# Altium project PCB_Project.PrjPcb
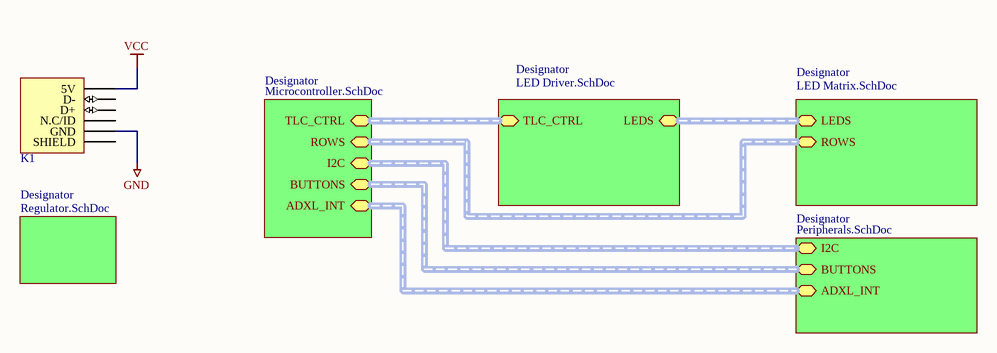
[diagram p0: RGB_Matrix.SchDoc]
6 sheets, 106 parts. Net scope: hierarchical (ports join the sheet entries above them; power ports are global).
Sheets:
  RGB_Matrix.SchDoc
    Designator = LED Matrix.SchDoc
    Designator = LED Driver.SchDoc
    Designator = Microcontroller.SchDoc
    Designator = Regulator.SchDoc
    Designator = Peripherals.SchDoc

## Sheet RGB_Matrix.SchDoc
size A

### Parts
K1  USB_CONNECTOR_5P  [USB_MINI_SMD]  (value not drawn)

### Sub-sheets
Designator = LED Matrix.SchDoc: LEDS (harness LEDS), ROWS (harness ROWS)
Designator = LED Driver.SchDoc: TLC_CTRL (harness TLC_CTRL), LEDS (harness LEDS)
Designator = Microcontroller.SchDoc: TLC_CTRL (harness TLC_CTRL), ROWS (harness ROWS), I2C (harness I2C), ADXL_INT (harness ADXL_INT), BUTTONS (harness BUTTONS)
Designator = Regulator.SchDoc: no entries
Designator = Peripherals.SchDoc: I2C (harness I2C), ADXL_INT (harness ADXL_INT), BUTTONS (harness BUTTONS)

### Nets
GND: K1.5(GND)
VCC: K1.1(5V)

Not connected (* = marked no-connect by the designer): K1 0(SHIELD) 2(D-) 3(D+) 4(N.C/ID)

### Library data of the parts
K1 = 1753: KONTAKT, SMD; id: 1753; rad: 11; rom: OV; lager_type: Fremlager; dybde: 1; hylle: 6; antall: 200; pakke_opprettet_av: 924; navn: USB mini; pris: 8; nokkelord: USB, USB mini, kontakt, SMD; kolonne: 1; pakke_opprettet: 30-Jul-15 6:08:19 PM; symbol_opprettet_av: 924; symbol_opprettet: 30-Jul-15 6:06:06 PM; pakketype: SMD

## Sheet LED Matrix.SchDoc
size A2
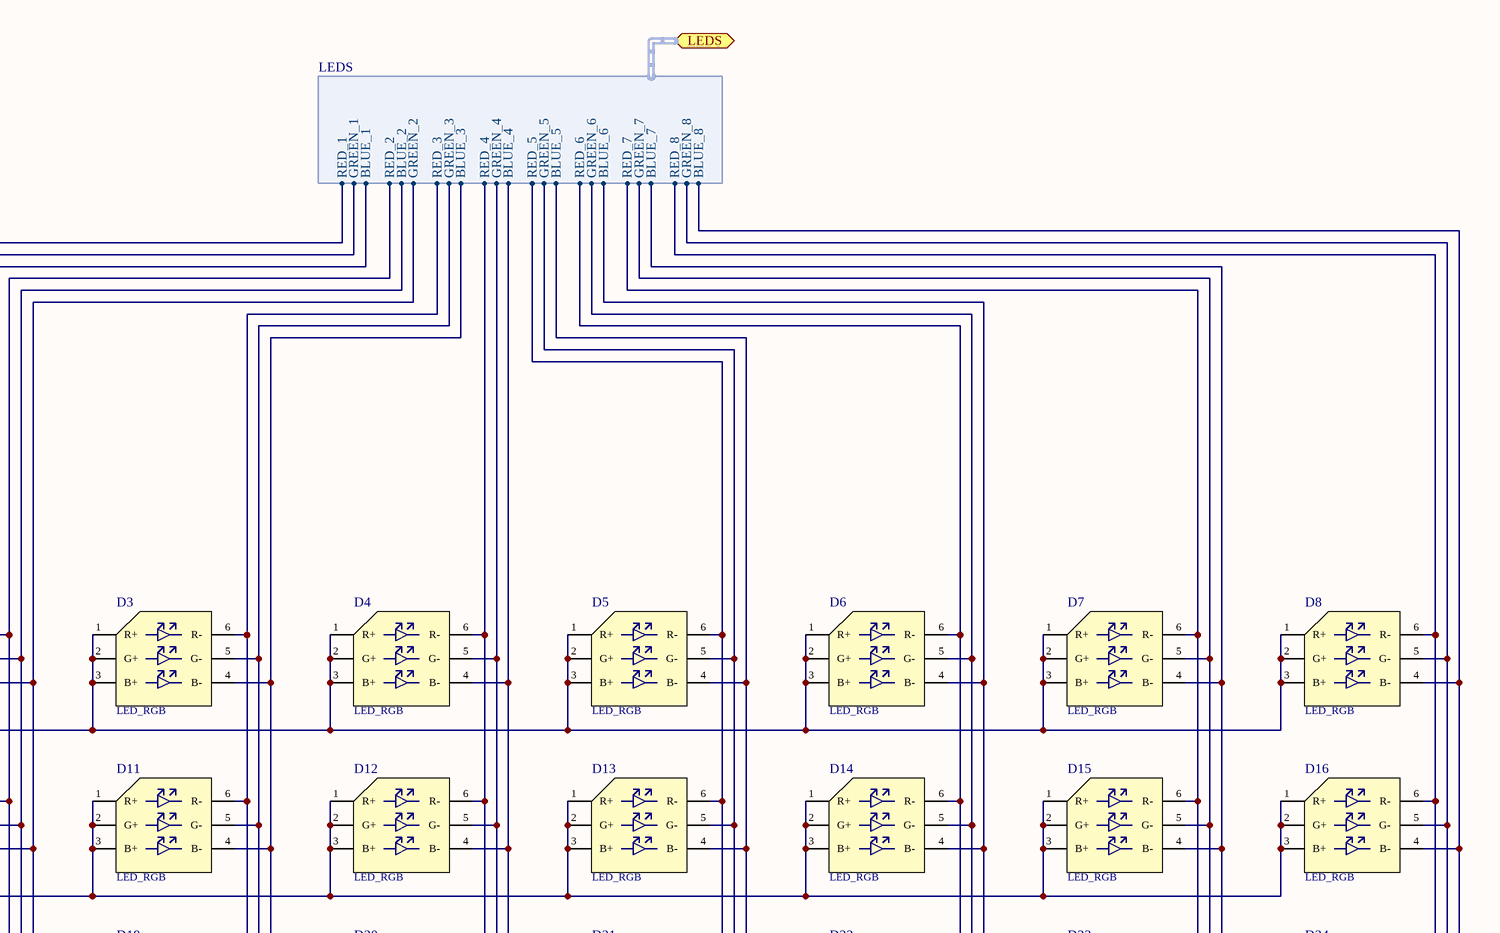
[diagram p1: LED Matrix.SchDoc, top right]
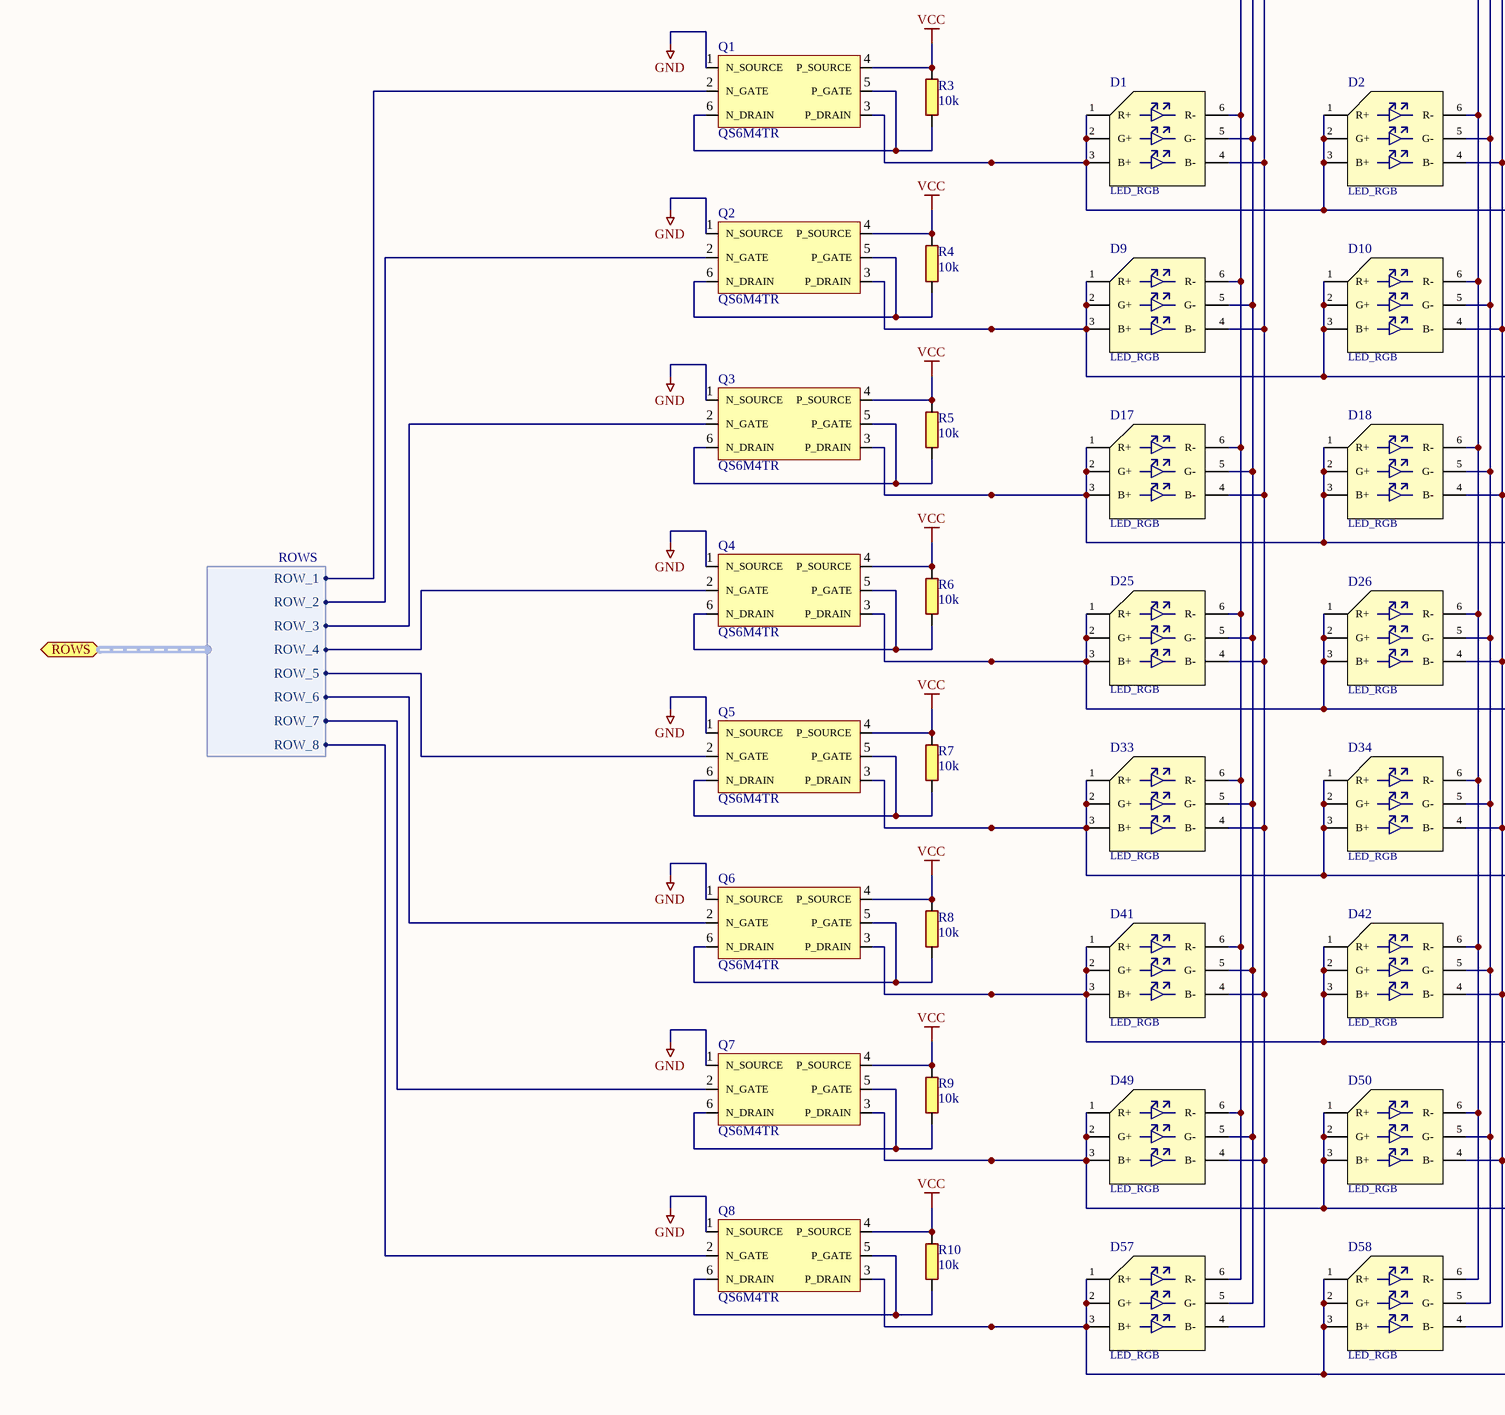
[diagram p2: LED Matrix.SchDoc, bottom left]
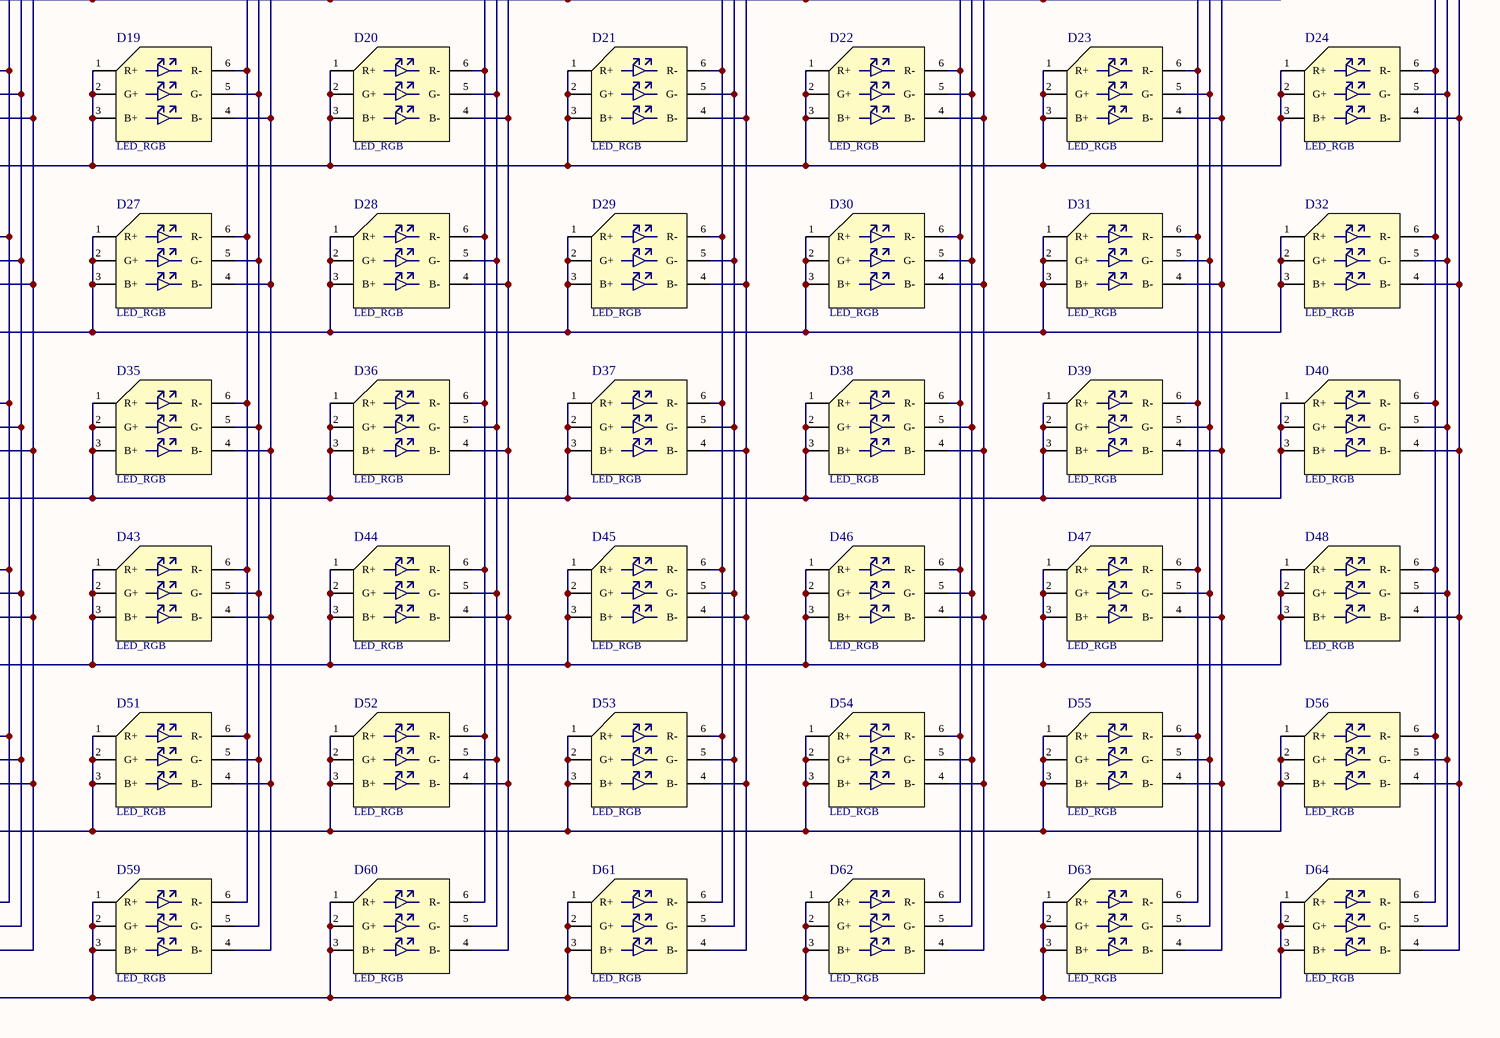
[diagram p3: LED Matrix.SchDoc, bottom right]

### Parts
D1  LED_RGB  [LED5050_RGB_N]
D2  LED_RGB  [LED5050_RGB_N]
D3  LED_RGB  [LED5050_RGB_N]
D4  LED_RGB  [LED5050_RGB_N]
D5  LED_RGB  [LED5050_RGB_N]
D6  LED_RGB  [LED5050_RGB_N]
D7  LED_RGB  [LED5050_RGB_N]
D8  LED_RGB  [LED5050_RGB_N]
D9  LED_RGB  [LED5050_RGB_N]
D10  LED_RGB  [LED5050_RGB_N]
D11  LED_RGB  [LED5050_RGB_N]
D12  LED_RGB  [LED5050_RGB_N]
D13  LED_RGB  [LED5050_RGB_N]
D14  LED_RGB  [LED5050_RGB_N]
D15  LED_RGB  [LED5050_RGB_N]
D16  LED_RGB  [LED5050_RGB_N]
D17  LED_RGB  [LED5050_RGB_N]
D18  LED_RGB  [LED5050_RGB_N]
D19  LED_RGB  [LED5050_RGB_N]
D20  LED_RGB  [LED5050_RGB_N]
D21  LED_RGB  [LED5050_RGB_N]
D22  LED_RGB  [LED5050_RGB_N]
D23  LED_RGB  [LED5050_RGB_N]
D24  LED_RGB  [LED5050_RGB_N]
D25  LED_RGB  [LED5050_RGB_N]
D26  LED_RGB  [LED5050_RGB_N]
D27  LED_RGB  [LED5050_RGB_N]
D28  LED_RGB  [LED5050_RGB_N]
D29  LED_RGB  [LED5050_RGB_N]
D30  LED_RGB  [LED5050_RGB_N]
D31  LED_RGB  [LED5050_RGB_N]
D32  LED_RGB  [LED5050_RGB_N]
D33  LED_RGB  [LED5050_RGB_N]
D34  LED_RGB  [LED5050_RGB_N]
D35  LED_RGB  [LED5050_RGB_N]
D36  LED_RGB  [LED5050_RGB_N]
D37  LED_RGB  [LED5050_RGB_N]
D38  LED_RGB  [LED5050_RGB_N]
D39  LED_RGB  [LED5050_RGB_N]
D40  LED_RGB  [LED5050_RGB_N]
D41  LED_RGB  [LED5050_RGB_N]
D42  LED_RGB  [LED5050_RGB_N]
D43  LED_RGB  [LED5050_RGB_N]
D44  LED_RGB  [LED5050_RGB_N]
D45  LED_RGB  [LED5050_RGB_N]
D46  LED_RGB  [LED5050_RGB_N]
D47  LED_RGB  [LED5050_RGB_N]
D48  LED_RGB  [LED5050_RGB_N]
D49  LED_RGB  [LED5050_RGB_N]
D50  LED_RGB  [LED5050_RGB_N]
D51  LED_RGB  [LED5050_RGB_N]
D52  LED_RGB  [LED5050_RGB_N]
D53  LED_RGB  [LED5050_RGB_N]
D54  LED_RGB  [LED5050_RGB_N]
D55  LED_RGB  [LED5050_RGB_N]
D56  LED_RGB  [LED5050_RGB_N]
D57  LED_RGB  [LED5050_RGB_N]
D58  LED_RGB  [LED5050_RGB_N]
D59  LED_RGB  [LED5050_RGB_N]
D60  LED_RGB  [LED5050_RGB_N]
D61  LED_RGB  [LED5050_RGB_N]
D62  LED_RGB  [LED5050_RGB_N]
D63  LED_RGB  [LED5050_RGB_N]
D64  LED_RGB  [LED5050_RGB_N]
Q1  QS6M4TR
Q2  QS6M4TR
Q3  QS6M4TR
Q4  QS6M4TR
Q5  QS6M4TR
Q6  QS6M4TR
Q7  QS6M4TR
Q8  QS6M4TR
R3  10k  [RESC0603(1608)_N]
R4  10k  [RESC0603(1608)_N]
R5  10k  [RESC0603(1608)_N]
R6  10k  [RESC0603(1608)_N]
R7  10k  [RESC0603(1608)_N]
R8  10k  [RESC0603(1608)_N]
R9  10k  [RESC0603(1608)_N]
R10  10k  [RESC0603(1608)_N]

### Ports
LEDS (harness LEDS), ROWS (harness ROWS)

### Harnesses
LEDS: BLUE_1, BLUE_2, BLUE_3, BLUE_4, BLUE_5, BLUE_6, BLUE_7, GREEN_1, GREEN_2, GREEN_3, GREEN_4, GREEN_5, GREEN_6, GREEN_7, GREEN_8, RED_1, RED_2, RED_3, RED_4, RED_5, RED_6, RED_7, RED_8, BLUE_8
ROWS: ROW_1, ROW_2, ROW_3, ROW_4, ROW_5, ROW_6, ROW_7, ROW_8

### Nets
GND: Q1.1(N_SOURCE) Q2.1(N_SOURCE) Q3.1(N_SOURCE) Q4.1(N_SOURCE) Q5.1(N_SOURCE) Q6.1(N_SOURCE) Q7.1(N_SOURCE) Q8.1(N_SOURCE)
VCC: Q1.4(P_SOURCE) Q2.4(P_SOURCE) Q3.4(P_SOURCE) Q4.4(P_SOURCE) Q5.4(P_SOURCE) Q6.4(P_SOURCE) Q7.4(P_SOURCE) Q8.4(P_SOURCE) R3.2 R4.2 R5.2 R6.2 R7.2 R8.2 R9.2 R10.2
NetD1_1: D1.1(R+) D1.2(G+) D1.3(B+) D2.1(R+) D2.2(G+) D2.3(B+) D3.1(R+) D3.2(G+) D3.3(B+) D4.1(R+) D4.2(G+) D4.3(B+) D5.1(R+) D5.2(G+) D5.3(B+) D6.1(R+) D6.2(G+) D6.3(B+) D7.1(R+) D7.2(G+) D7.3(B+) D8.1(R+) D8.2(G+) D8.3(B+) Q1.3(P_DRAIN)
NetD1_4: D1.4(B-) D9.4(B-) D17.4(B-) D25.4(B-) D33.4(B-) D41.4(B-) D49.4(B-) D57.4(B-) ; port LEDS.BLUE_1
NetD1_5: D1.5(G-) D9.5(G-) D17.5(G-) D25.5(G-) D33.5(G-) D41.5(G-) D49.5(G-) D57.5(G-) ; port LEDS.GREEN_1
NetD1_6: D1.6(R-) D9.6(R-) D17.6(R-) D25.6(R-) D33.6(R-) D41.6(R-) D49.6(R-) D57.6(R-) ; port LEDS.RED_1
NetD2_4: D2.4(B-) D10.4(B-) D18.4(B-) D26.4(B-) D34.4(B-) D42.4(B-) D50.4(B-) D58.4(B-) ; port LEDS.GREEN_2
NetD2_5: D2.5(G-) D10.5(G-) D18.5(G-) D26.5(G-) D34.5(G-) D42.5(G-) D50.5(G-) D58.5(G-) ; port LEDS.BLUE_2
NetD2_6: D2.6(R-) D10.6(R-) D18.6(R-) D26.6(R-) D34.6(R-) D42.6(R-) D50.6(R-) D58.6(R-) ; port LEDS.RED_2
NetD3_4: D3.4(B-) D11.4(B-) D19.4(B-) D27.4(B-) D35.4(B-) D43.4(B-) D51.4(B-) D59.4(B-) ; port LEDS.BLUE_3
NetD3_5: D3.5(G-) D11.5(G-) D19.5(G-) D27.5(G-) D35.5(G-) D43.5(G-) D51.5(G-) D59.5(G-) ; port LEDS.GREEN_3
NetD3_6: D3.6(R-) D11.6(R-) D19.6(R-) D27.6(R-) D35.6(R-) D43.6(R-) D51.6(R-) D59.6(R-) ; port LEDS.RED_3
NetD4_4: D4.4(B-) D12.4(B-) D20.4(B-) D28.4(B-) D36.4(B-) D44.4(B-) D52.4(B-) D60.4(B-) ; port LEDS.BLUE_4
NetD4_5: D4.5(G-) D12.5(G-) D20.5(G-) D28.5(G-) D36.5(G-) D44.5(G-) D52.5(G-) D60.5(G-) ; port LEDS.GREEN_4
NetD4_6: D4.6(R-) D12.6(R-) D20.6(R-) D28.6(R-) D36.6(R-) D44.6(R-) D52.6(R-) D60.6(R-) ; port LEDS.RED_4
NetD5_4: D5.4(B-) D13.4(B-) D21.4(B-) D29.4(B-) D37.4(B-) D45.4(B-) D53.4(B-) D61.4(B-) ; port LEDS.BLUE_5
NetD5_5: D5.5(G-) D13.5(G-) D21.5(G-) D29.5(G-) D37.5(G-) D45.5(G-) D53.5(G-) D61.5(G-) ; port LEDS.GREEN_5
NetD5_6: D5.6(R-) D13.6(R-) D21.6(R-) D29.6(R-) D37.6(R-) D45.6(R-) D53.6(R-) D61.6(R-) ; port LEDS.RED_5
NetD6_4: D6.4(B-) D14.4(B-) D22.4(B-) D30.4(B-) D38.4(B-) D46.4(B-) D54.4(B-) D62.4(B-) ; port LEDS.BLUE_6
NetD6_5: D6.5(G-) D14.5(G-) D22.5(G-) D30.5(G-) D38.5(G-) D46.5(G-) D54.5(G-) D62.5(G-) ; port LEDS.GREEN_6
NetD6_6: D6.6(R-) D14.6(R-) D22.6(R-) D30.6(R-) D38.6(R-) D46.6(R-) D54.6(R-) D62.6(R-) ; port LEDS.RED_6
NetD7_4: D7.4(B-) D15.4(B-) D23.4(B-) D31.4(B-) D39.4(B-) D47.4(B-) D55.4(B-) D63.4(B-) ; port LEDS.BLUE_7
NetD7_5: D7.5(G-) D15.5(G-) D23.5(G-) D31.5(G-) D39.5(G-) D47.5(G-) D55.5(G-) D63.5(G-) ; port LEDS.GREEN_7
NetD7_6: D7.6(R-) D15.6(R-) D23.6(R-) D31.6(R-) D39.6(R-) D47.6(R-) D55.6(R-) D63.6(R-) ; port LEDS.RED_7
NetD8_4: D8.4(B-) D16.4(B-) D24.4(B-) D32.4(B-) D40.4(B-) D48.4(B-) D56.4(B-) D64.4(B-) ; port LEDS.BLUE_8
NetD8_5: D8.5(G-) D16.5(G-) D24.5(G-) D32.5(G-) D40.5(G-) D48.5(G-) D56.5(G-) D64.5(G-) ; port LEDS.GREEN_8
NetD8_6: D8.6(R-) D16.6(R-) D24.6(R-) D32.6(R-) D40.6(R-) D48.6(R-) D56.6(R-) D64.6(R-) ; port LEDS.RED_8
NetD9_1: D9.1(R+) D9.2(G+) D9.3(B+) D10.1(R+) D10.2(G+) D10.3(B+) D11.1(R+) D11.2(G+) D11.3(B+) D12.1(R+) D12.2(G+) D12.3(B+) D13.1(R+) D13.2(G+) D13.3(B+) D14.1(R+) D14.2(G+) D14.3(B+) D15.1(R+) D15.2(G+) D15.3(B+) D16.1(R+) D16.2(G+) D16.3(B+) Q2.3(P_DRAIN)
NetD17_1: D17.1(R+) D17.2(G+) D17.3(B+) D18.1(R+) D18.2(G+) D18.3(B+) D19.1(R+) D19.2(G+) D19.3(B+) D20.1(R+) D20.2(G+) D20.3(B+) D21.1(R+) D21.2(G+) D21.3(B+) D22.1(R+) D22.2(G+) D22.3(B+) D23.1(R+) D23.2(G+) D23.3(B+) D24.1(R+) D24.2(G+) D24.3(B+) Q3.3(P_DRAIN)
NetD25_1: D25.1(R+) D25.2(G+) D25.3(B+) D26.1(R+) D26.2(G+) D26.3(B+) D27.1(R+) D27.2(G+) D27.3(B+) D28.1(R+) D28.2(G+) D28.3(B+) D29.1(R+) D29.2(G+) D29.3(B+) D30.1(R+) D30.2(G+) D30.3(B+) D31.1(R+) D31.2(G+) D31.3(B+) D32.1(R+) D32.2(G+) D32.3(B+) Q4.3(P_DRAIN)
NetD33_1: D33.1(R+) D33.2(G+) D33.3(B+) D34.1(R+) D34.2(G+) D34.3(B+) D35.1(R+) D35.2(G+) D35.3(B+) D36.1(R+) D36.2(G+) D36.3(B+) D37.1(R+) D37.2(G+) D37.3(B+) D38.1(R+) D38.2(G+) D38.3(B+) D39.1(R+) D39.2(G+) D39.3(B+) D40.1(R+) D40.2(G+) D40.3(B+) Q5.3(P_DRAIN)
NetD41_1: D41.1(R+) D41.2(G+) D41.3(B+) D42.1(R+) D42.2(G+) D42.3(B+) D43.1(R+) D43.2(G+) D43.3(B+) D44.1(R+) D44.2(G+) D44.3(B+) D45.1(R+) D45.2(G+) D45.3(B+) D46.1(R+) D46.2(G+) D46.3(B+) D47.1(R+) D47.2(G+) D47.3(B+) D48.1(R+) D48.2(G+) D48.3(B+) Q6.3(P_DRAIN)
NetD49_1: D49.1(R+) D49.2(G+) D49.3(B+) D50.1(R+) D50.2(G+) D50.3(B+) D51.1(R+) D51.2(G+) D51.3(B+) D52.1(R+) D52.2(G+) D52.3(B+) D53.1(R+) D53.2(G+) D53.3(B+) D54.1(R+) D54.2(G+) D54.3(B+) D55.1(R+) D55.2(G+) D55.3(B+) D56.1(R+) D56.2(G+) D56.3(B+) Q7.3(P_DRAIN)
NetD57_1: D57.1(R+) D57.2(G+) D57.3(B+) D58.1(R+) D58.2(G+) D58.3(B+) D59.1(R+) D59.2(G+) D59.3(B+) D60.1(R+) D60.2(G+) D60.3(B+) D61.1(R+) D61.2(G+) D61.3(B+) D62.1(R+) D62.2(G+) D62.3(B+) D63.1(R+) D63.2(G+) D63.3(B+) D64.1(R+) D64.2(G+) D64.3(B+) Q8.3(P_DRAIN)
NetQ1_2: Q1.2(N_GATE) ; port ROWS.ROW_1
NetQ1_5: Q1.5(P_GATE) Q1.6(N_DRAIN) R3.1
NetQ2_2: Q2.2(N_GATE) ; port ROWS.ROW_2
NetQ2_5: Q2.5(P_GATE) Q2.6(N_DRAIN) R4.1
NetQ3_2: Q3.2(N_GATE) ; port ROWS.ROW_3
NetQ3_5: Q3.5(P_GATE) Q3.6(N_DRAIN) R5.1
NetQ4_2: Q4.2(N_GATE) ; port ROWS.ROW_4
NetQ4_5: Q4.5(P_GATE) Q4.6(N_DRAIN) R6.1
NetQ5_2: Q5.2(N_GATE) ; port ROWS.ROW_5
NetQ5_5: Q5.5(P_GATE) Q5.6(N_DRAIN) R7.1
NetQ6_2: Q6.2(N_GATE) ; port ROWS.ROW_6
NetQ6_5: Q6.5(P_GATE) Q6.6(N_DRAIN) R8.1
NetQ7_2: Q7.2(N_GATE) ; port ROWS.ROW_7
NetQ7_5: Q7.5(P_GATE) Q7.6(N_DRAIN) R9.1
NetQ8_2: Q8.2(N_GATE) ; port ROWS.ROW_8
NetQ8_5: Q8.5(P_GATE) Q8.6(N_DRAIN) R10.1

### Library data of the parts
D1-D64 = 3348: LED RGB, independent colors; id: 3348; rad: 7; rom: OV; lager_type: Fremlager; dybde: 0; hylle: 6; antall: 300; pakke_opprettet_av: 924; beskrivelse: SMD; navn: LED RGB; pris: 1; kolonne: 0; pakke_opprettet: 12/17/2015 2:22:54 AM; symbol_opprettet_av: 924; symbol_opprettet: 12/17/2015 2:22:13 AM; pakketype: SMD
R3-R10 = 2444: 0.1W 1% Thick film resistor; id: 2444; rad: -1; rom: OV; lager_type: Fremlager; dybde: 72; hylle: 6; antall: 90; kolonne: 0; pakke_opprettet_av: 815; leverandor_varenr: 2447230; nokkelord: Resistor Motstand; produsent: Multikomp; leverandor: Farnell; pakketype: 0603; pakke_opprettet: 08-Jul-14 9:15:30 PM; symbol_opprettet_av: 815; symbol_opprettet: 08-Jul-14 9:16:33 PM; navn: 10k; pris: 0

## Sheet LED Driver.SchDoc
size A4
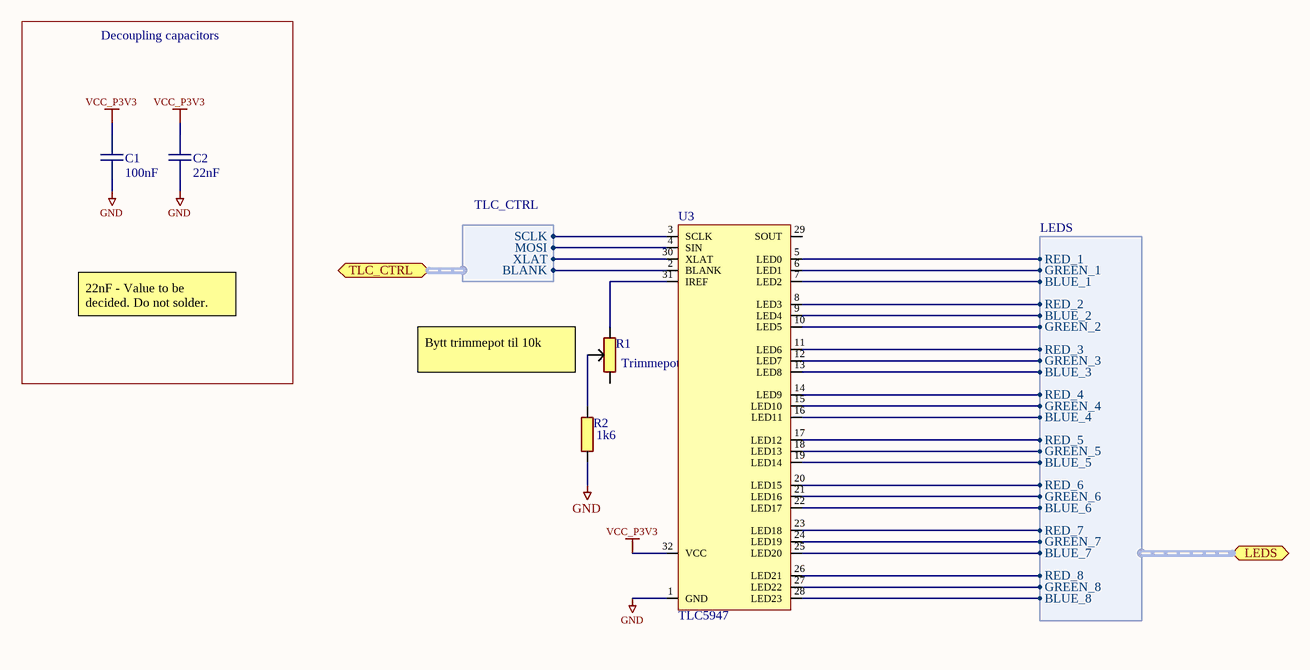
[diagram p4: LED Driver.SchDoc]

### Parts
C1  100nF  [CAPC0603(1608)55_N]
C2  22nF  [CAPC0805(2012)100_N]
R1  Trimmepot 500ohm  [TRIMPOT_3006P]
R2  1k6  [RESC0603(1608)_N]
U3  TLC5947

### Blocks framed on the sheet
Decoupling capacitors: C1 C2

### Ports
LEDS (harness LEDS), TLC_CTRL (harness TLC_CTRL)

### Harnesses
TLC_CTRL: SCLK, MOSI, XLAT, BLANK
LEDS: BLUE_1, BLUE_2, BLUE_3, BLUE_4, BLUE_5, BLUE_6, BLUE_7, GREEN_1, GREEN_2, GREEN_3, GREEN_4, GREEN_5, GREEN_6, GREEN_7, GREEN_8, RED_1, RED_2, RED_3, RED_4, RED_5, RED_6, RED_7, RED_8, BLUE_8

### Nets
GND: C1.1 C2.1 R2.1 U3.1(GND)
VCC_P3V3: C1.2 C2.2 U3.32(VCC)
NetD1_4: U3.7(LED2) ; port LEDS.BLUE_1
NetD1_5: U3.6(LED1) ; port LEDS.GREEN_1
NetD1_6: U3.5(LED0) ; port LEDS.RED_1
NetD2_4: U3.10(LED5) ; port LEDS.GREEN_2
NetD2_5: U3.9(LED4) ; port LEDS.BLUE_2
NetD2_6: U3.8(LED3) ; port LEDS.RED_2
NetD3_4: U3.13(LED8) ; port LEDS.BLUE_3
NetD3_5: U3.12(LED7) ; port LEDS.GREEN_3
NetD3_6: U3.11(LED6) ; port LEDS.RED_3
NetD4_4: U3.16(LED11) ; port LEDS.BLUE_4
NetD4_5: U3.15(LED10) ; port LEDS.GREEN_4
NetD4_6: U3.14(LED9) ; port LEDS.RED_4
NetD5_4: U3.19(LED14) ; port LEDS.BLUE_5
NetD5_5: U3.18(LED13) ; port LEDS.GREEN_5
NetD5_6: U3.17(LED12) ; port LEDS.RED_5
NetD6_4: U3.22(LED17) ; port LEDS.BLUE_6
NetD6_5: U3.21(LED16) ; port LEDS.GREEN_6
NetD6_6: U3.20(LED15) ; port LEDS.RED_6
NetD7_4: U3.25(LED20) ; port LEDS.BLUE_7
NetD7_5: U3.24(LED19) ; port LEDS.GREEN_7
NetD7_6: U3.23(LED18) ; port LEDS.RED_7
NetD8_4: U3.28(LED23) ; port LEDS.BLUE_8
NetD8_5: U3.27(LED22) ; port LEDS.GREEN_8
NetD8_6: U3.26(LED21) ; port LEDS.RED_8
NetR1_2: R1.2 R2.2
NetR1_3: R1.3 U3.31(IREF)
NetU1_10: U3.30(XLAT) ; port TLC_CTRL.XLAT
NetU1_11: U3.2(BLANK) ; port TLC_CTRL.BLANK
NetU1_15: U3.4(SIN) ; port TLC_CTRL.MOSI
NetU1_17: U3.3(SCLK) ; port TLC_CTRL.SCLK

Not connected (* = marked no-connect by the designer): R1 1; U3 29(SOUT)

### Notes on the sheet
- 22nF - Value to be decided. Do not solder.
- Bytt trimmepot til 10k
- Size:
- Date:
- Title:
- A3
- Revision:
- Sheet
- of
- Author:
- File:

### Library data of the parts
C1 = 3028: X7R 50V 5%; id: 3028; pakke_opprettet_av: 815; leverandor_varenr: 1759122; pris: 1; nokkelord: Kondensator, Capacitor, CAP; produsent: Multikomp; leverandor: Farnell; pakketype: 0603; pakke_opprettet: 18-Feb-15 2:18:13 PM; symbol_opprettet_av: 815; symbol_opprettet: 14-Nov-14 8:19:34 PM; navn: 100nF
C2 = 2446: X7R 50V; id: 2446; pakke_opprettet_av: 815; leverandor_varenr: 2627092; pris: 1; nokkelord: Capacitor Cap Kondis; produsent: Multicomp; leverandor: Farnell; pakketype: 0805; pakke_opprettet: 11/14/2014 8:52:01 PM; symbol_opprettet_av: 815; symbol_opprettet: 11/14/2014 8:19:34 PM; navn: 22nF
R1 = 1365: 15 turn, horizontal; id: 1365; rad: 1; rom: OV; lager_type: Fremlager; dybde: 2; hylle: 7; antall: 50; pakke_opprettet_av: 815; leverandor_varenr: 9352376; pris: 15; nokkelord: trimpot; produsent: Bourns; leverandor: Farnell; pakketype: TH; kolonne: 1; pakke_opprettet: 2/10/2017 3:29:47 PM; symbol_opprettet_av: 815; symbol_opprettet: 11/3/2016 3:34:07 PM; navn: Trimmepot 500ohm
R2 = 3446: 0.1W 1% Thick film resistor; id: 3446; rad: -1; rom: OV; lager_type: Fremlager; dybde: 53; hylle: 6; antall: 100; kolonne: 0; pakke_opprettet_av: 815; pakketype: 0603; pakke_opprettet: 7/8/2014 9:15:30 PM; symbol_opprettet_av: 815; symbol_opprettet: 7/8/2014 9:16:33 PM; navn: 1k6; pris: 0

## Sheet Microcontroller.SchDoc
size A4
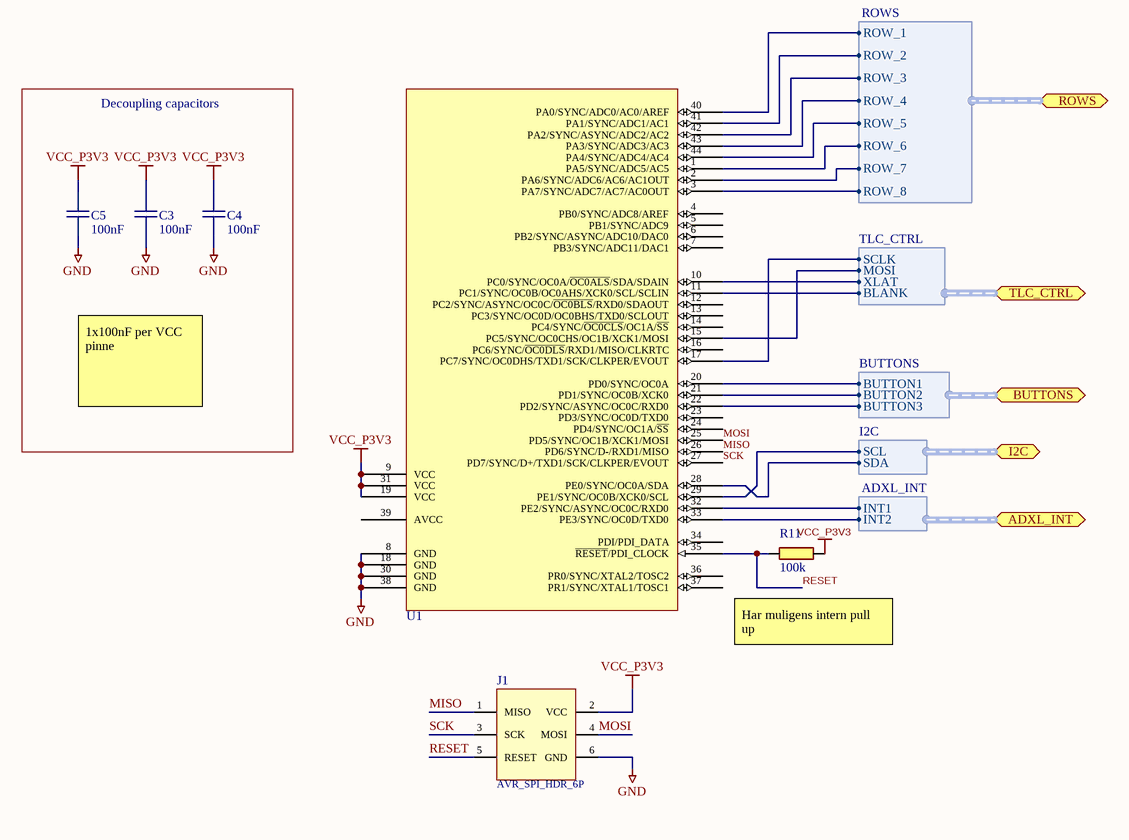
[diagram p5: Microcontroller.SchDoc]

### Parts
C3  100nF  [CAPC0805(2012)100_N]
C4  100nF  [CAPC0805(2012)100_N]
C5  100nF  [CAPC0805(2012)100_N]
J1  AVR_SPI_HDR_6P  [HEADER_3x2]
R11  100k  [RESC0603(1608)_N]
U1  ATXMEGA-A4U  [TQFP80P1200X1200X120-44N]  (value not drawn)

### Blocks framed on the sheet
Decoupling capacitors: C3-C5

### Ports
ADXL_INT (harness ADXL_INT), BUTTONS (harness BUTTONS), I2C (harness I2C), ROWS (harness ROWS), TLC_CTRL (harness TLC_CTRL)

### Harnesses
ROWS: ROW_1, ROW_2, ROW_3, ROW_4, ROW_5, ROW_6, ROW_7, ROW_8
TLC_CTRL: SCLK, MOSI, XLAT, BLANK
I2C: SCL, SDA
ADXL_INT: INT1, INT2
BUTTONS: BUTTON1, BUTTON2, BUTTON3

### Nets
GND: C3.1 C4.1 C5.1 J1.6(GND) U1.8(GND) U1.18(GND) U1.30(GND) U1.38(GND)
VCC_P3V3: C3.2 C4.2 C5.2 J1.2(VCC) R11.1 U1.9(VCC) U1.19(VCC) U1.31(VCC)
MISO: J1.1(MISO) U1.26(PD6/SYNC/D-/RXD1/MISO)
MOSI: J1.4(MOSI) U1.25(PD5/SYNC/OC1B/XCK1/MOSI)
RESET: J1.5(RESET) R11.2 U1.35(~{RESET}/PDI_CLOCK)
SCK: J1.3(SCK) U1.27(PD7/SYNC/D+/TXD1/SCK/CLKPER/EVOUT)
NetJ2_2: U1.20(PD0/SYNC/OC0A) ; port BUTTONS.BUTTON1
NetQ1_2: U1.40(PA0/SYNC/ADC0/AC0/AREF) ; port ROWS.ROW_1
NetQ2_2: U1.41(PA1/SYNC/ADC1/AC1) ; port ROWS.ROW_2
NetQ3_2: U1.42(PA2/SYNC/ASYNC/ADC2/AC2) ; port ROWS.ROW_3
NetQ4_2: U1.43(PA3/SYNC/ADC3/AC3) ; port ROWS.ROW_4
NetQ5_2: U1.44(PA4/SYNC/ADC4/AC4) ; port ROWS.ROW_5
NetQ6_2: U1.1(PA5/SYNC/ADC5/AC5) ; port ROWS.ROW_6
NetQ7_2: U1.2(PA6/SYNC/ADC6/AC6/AC1OUT) ; port ROWS.ROW_7
NetQ8_2: U1.3(PA7/SYNC/ADC7/AC7/AC0OUT) ; port ROWS.ROW_8
NetR12_1: U1.29(PE1/SYNC/OC0B/XCK0/SCL) ; port I2C.SCL
NetR13_1: U1.28(PE0/SYNC/OC0A/SDA) ; port I2C.SDA
NetR14_1: U1.21(PD1/SYNC/OC0B/XCK0) ; port BUTTONS.BUTTON2
NetR15_1: U1.22(PD2/SYNC/ASYNC/OC0C/RXD0) ; port BUTTONS.BUTTON3
NetU1_10: U1.10(PC0/SYNC/OC0A/~{OC0ALS}/SDA/SDAIN) ; port TLC_CTRL.XLAT
NetU1_11: U1.11(PC1/SYNC/OC0B/OC0AHS/XCK0/SCL/SCLIN) ; port TLC_CTRL.BLANK
NetU1_15: U1.15(PC5/SYNC/OC0CHS/OC1B/XCK1/MOSI) ; port TLC_CTRL.MOSI
NetU1_17: U1.17(PC7/SYNC/OC0DHS/TXD1/SCK/CLKPER/EVOUT) ; port TLC_CTRL.SCLK
NetU1_32: U1.32(PE2/SYNC/ASYNC/OC0C/RXD0) ; port ADXL_INT.INT1
NetU1_33: U1.33(PE3/SYNC/OC0D/TXD0) ; port ADXL_INT.INT2

Not connected (* = marked no-connect by the designer): U1 4(PB0/SYNC/ADC8/AREF) 5(PB1/SYNC/ADC9) 6(PB2/SYNC/ASYNC/ADC10/DAC0) 7(PB3/SYNC/ADC11/DAC1) 12(PC2/SYNC/ASYNC/OC0C/~{OC0BLS}/RXD0/SDAOUT) 13(PC3/SYNC/OC0D/OC0BHS/TXD0/SCLOUT) 14(PC4/SYNC/~{OC0CLS}/OC1A/~{SS}) 16(PC6/SYNC/~{OC0DLS}/RXD1/MISO/CLKRTC) 23(PD3/SYNC/OC0D/TXD0) 24(PD4/SYNC/OC1A/~{SS}) 34(PDI/PDI_DATA) 36(PR0/SYNC/XTAL2/TOSC2) 37(PR1/SYNC/XTAL1/TOSC1) 39(AVCC)

### Notes on the sheet
- 1x100nF per VCC pinne
- Har muligens intern pull up

### Library data of the parts
C3-C5 = 2445: X7R 50V; id: 2445; rad: 1; rom: OV; lager_type: Fremlager; dybde: 4; hylle: 13; antall: 50; kolonne: 3; pakke_opprettet_av: 815; leverandor_varenr: 2408556; nokkelord: Kondensator, capacitor; produsent: Multikomp; leverandor: Farnell; pakketype: 0805; pakke_opprettet: 11/14/2014 8:52:01 PM; symbol_opprettet_av: 815; symbol_opprettet: 11/14/2014 8:19:34 PM; navn: 100nF; pris: 1
J1 = 3052: 6-pins ISP header for AVR; id: 3052; pakke_opprettet_av: 774; symbol_opprettet_av: 924; pris: 6; nokkelord: Programming, SPI; pakketype: TH; pakke_opprettet: 8/23/2014 1:37:50 PM; symbol_opprettet: 5/24/2015 1:27:07 AM; navn: AVR_SPI_HDR
R11 = 2384: 0.1W 1% Thick film resistor; id: 2384; rad: -1; rom: OV; lager_type: Fremlager; dybde: 96; hylle: 6; antall: 100; kolonne: 0; pakke_opprettet_av: 815; pakketype: 0603; pakke_opprettet: 08.07.2014 21:15:30; symbol_opprettet_av: 815; symbol_opprettet: 08.07.2014 21:16:33; navn: 100k; pris: 0; nokkelord: Resistor
U1 = 2103: id: 2103; rad: 4; rom: OV; lager_type: Fremlager; dybde: 0; antall: 82; kolonne: 2; pakke_opprettet_av: 774; beskrivelse: Mikrokontroller; navn: ATXMEGA64A4U-AU; produsent: Atmel; pakketype: TQFP; hylle: 0; pakke_opprettet: 8/22/2014 2:00:28 PM; symbol_opprettet_av: 774; symbol_opprettet: 8/22/2014 2:00:55 PM; pris: 0

## Sheet Regulator.SchDoc
size A
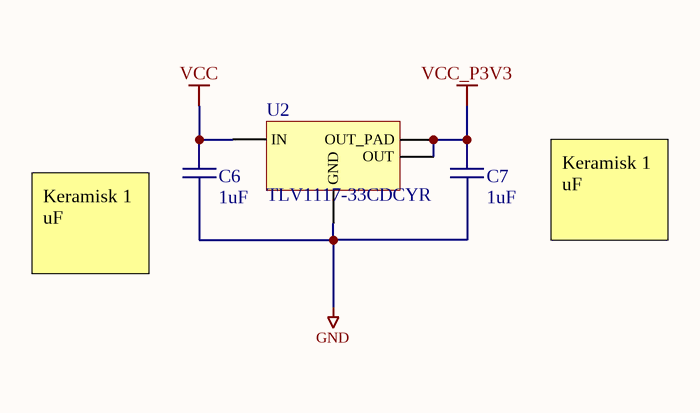
[diagram p6: Regulator.SchDoc]

### Parts
C6  1uF  [CAPC0805(2012)100_N]
C7  1uF  [CAPC0805(2012)100_N]
U2  TLV1117-33CDCYR  [SOT230P700X180-4N]

### Nets
GND: C6.1 C7.1 U2.1(GND)
VCC: C6.2 U2.3(IN)
VCC_P3V3: C7.2 U2.2(OUT_PAD) U2.4(OUT)

### Notes on the sheet
- (near C6) Keramisk 1 uF
- (near C7) Keramisk 1 uF

### Library data of the parts
C6 C7 = 3582: X7R 50V 10%; id: 3582; pakke_opprettet_av: 815; leverandor_varenr: 1735541; pris: 4; nokkelord: Kondensator, capacitor; produsent: Murata; leverandor: Farnell; pakketype: 0805; pakke_opprettet: 14-Nov-14 8:52:01 PM; symbol_opprettet_av: 815; symbol_opprettet: 14-Nov-14 8:19:34 PM; navn: 1uF
U2 = 2386: 3,3V Low dropout regulator; id: 2386; rad: 2; rom: OV; lager_type: Fremlager; dybde: 0; hylle: 9; antall: 63; pakke_opprettet_av: 774; leverandor_varenr: 2447986; pris: 5; nokkelord: ldo; produsent: Texas Instruments; leverandor: Farnell; pakketype: SOT; kolonne: 0; pakke_opprettet: 7/11/2014 10:00:23 PM; symbol_opprettet_av: 774; symbol_opprettet: 7/11/2014 10:01:42 PM; navn: TLV1117-33CDCYR

## Sheet Peripherals.SchDoc
size A
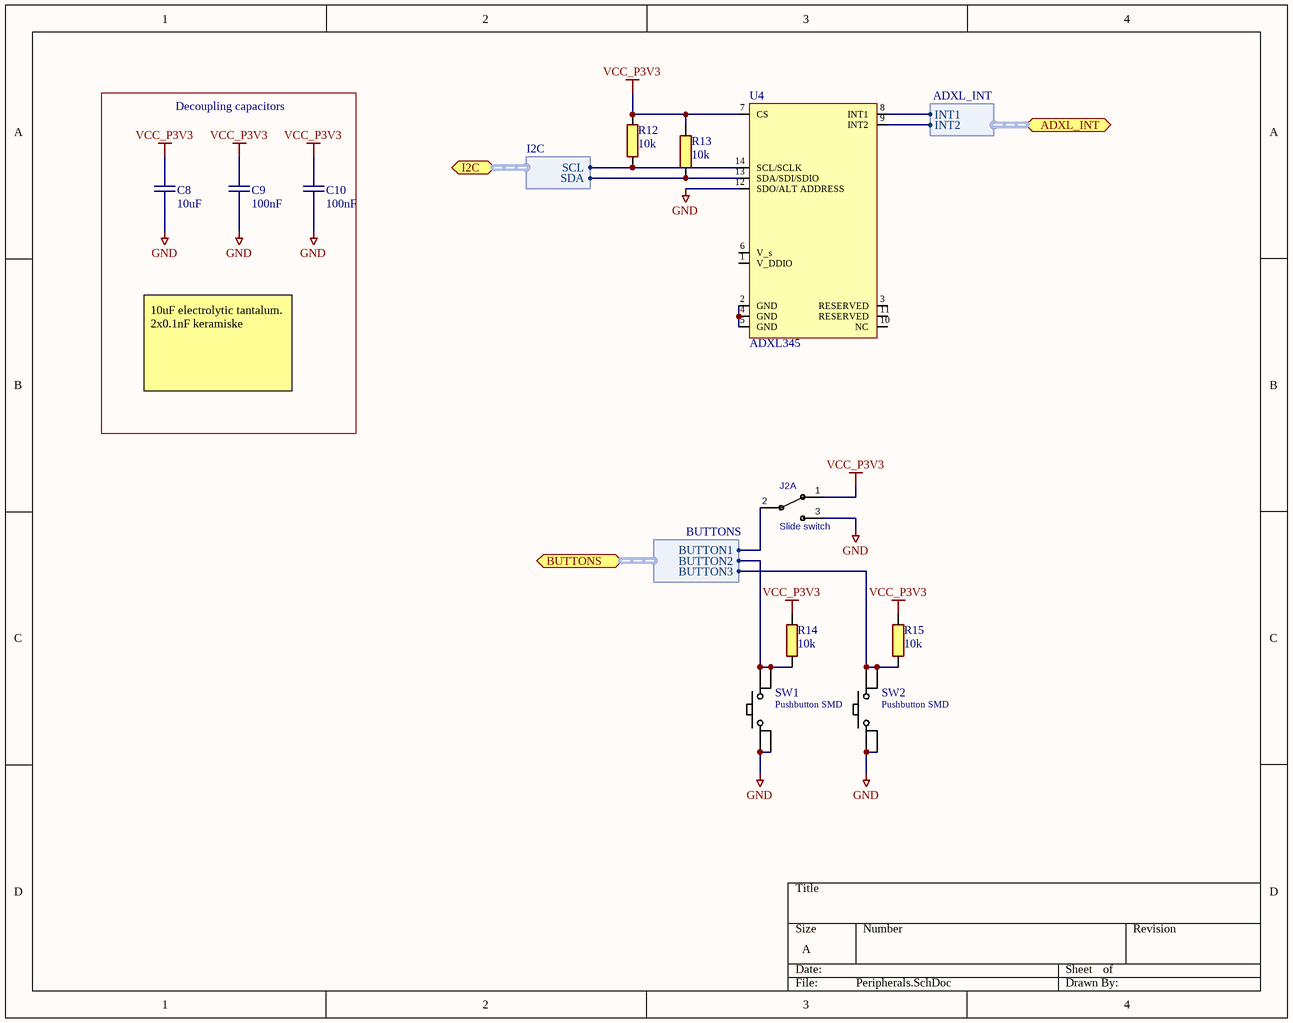
[diagram p7: Peripherals.SchDoc]

### Parts
C8  10uF  [CAPC1206(3216)170_N]
C9  100nF  [CAPC0603(1608)55_N]
C10  100nF  [CAPC0603(1608)55_N]
J2  Slide switch  [OS202011MA0QS1]  (part A of 2)
R12  10k  [RESC0603(1608)_N]
R13  10k  [RESC0603(1608)_N]
R14  10k  [RESC0603(1608)_N]
R15  10k  [RESC0603(1608)_N]
SW1  Pushbutton SMD  [SOIC254P500X160-4]
SW2  Pushbutton SMD  [SOIC254P500X160-4]
U4  ADXL345

### Blocks framed on the sheet
Decoupling capacitors: C8-C10

### Ports
ADXL_INT (harness ADXL_INT), BUTTONS (harness BUTTONS), I2C (harness I2C)

### Harnesses
I2C: SCL, SDA
BUTTONS: BUTTON1, BUTTON2, BUTTON3
ADXL_INT: INT1, INT2

### Nets
GND: C8.1 C9.1 C10.1 J2.3 SW1.1 SW1.2 SW2.1 SW2.2 U4.12(SDO/ALT_ADDRESS)
VCC_P3V3: C8.2 C9.2 C10.2 J2.1 R12.2 R13.2 R14.2 R15.2 U4.7(CS)
NetJ2_2: J2.2 ; port BUTTONS.BUTTON1
NetR12_1: R12.1 U4.14(SCL/SCLK) ; port I2C.SCL
NetR13_1: R13.1 U4.13(SDA/SDI/SDIO) ; port I2C.SDA
NetR14_1: R14.1 SW1.3 SW1.4 ; port BUTTONS.BUTTON2
NetR15_1: R15.1 SW2.3 SW2.4 ; port BUTTONS.BUTTON3
NetU1_32: U4.8(INT1) ; port ADXL_INT.INT1
NetU1_33: U4.9(INT2) ; port ADXL_INT.INT2
NetU4_2: U4.2(GND) U4.4(GND) U4.5(GND)

Not connected (* = marked no-connect by the designer): U4 1(V_DDIO) 3(RESERVED) 6(V_s) 10(NC) 11(RESERVED)

### Notes on the sheet
- 10uF electrolytic tantalum.
  2x0.1nF keramiske

### Library data of the parts
C8 = 3583: X5R 50V 10%; id: 3583; pakke_opprettet_av: 815; leverandor_varenr: 1845762; pris: 6; nokkelord: Kondensator, capacitor; produsent: Murata; leverandor: Farnell; pakketype: 1206; pakke_opprettet: 11-Feb-15 1:21:22 PM; symbol_opprettet_av: 815; symbol_opprettet: 14-Nov-14 8:19:34 PM; navn: 10uF
C9 C10 = 3028: as C1 on sheet LED Driver; pakke_opprettet: 18-Feb-15 2:18:13 PM; symbol_opprettet_av: 815; symbol_opprettet: 14-Nov-14 8:19:34 PM; navn: 100nF
J2 = 4031: Vinklet; id: 4031; pakke_opprettet_av: 1335; leverandor_varenr: 2435101; navn: Bryter DPDT; pris: 0; nokkelord: right angle slide switch; leverandor: Farnell; pakketype: TH; pakke_opprettet: 20-Feb-17 6:08:34 PM; symbol_opprettet_av: 1335; symbol_opprettet: 20-Feb-17 6:08:19 PM
R12-R15 = 2444: as R3 on sheet LED Matrix; pakke_opprettet: 08-Jul-14 9:15:30 PM; symbol_opprettet_av: 815; symbol_opprettet: 08-Jul-14 9:16:33 PM; navn: 10k; pris: 0
SW1 SW2 = 2413: id: 2413; rad: 5; rom: OV; lager_type: Fremlager; dybde: 1; hylle: 6; antall: 100; pakke_opprettet_av: 815; beskrivelse: Momentary tactile pushbutton SMD; pris: 2; nokkelord: smd, tactile, pushbutton, knapp, smd; kolonne: 1; pakke_opprettet: 14-Nov-14 10:12:31 PM; symbol_opprettet_av: 815; symbol_opprettet: 14-Nov-14 9:57:30 PM; navn: Pushbutton SMD; pakketype: SMD

## Nets that join several sheets
GND: RGB_Matrix (K1.5), LED Matrix (8 pins), LED Driver (C1.1 C2.1 R2.1 U3.1), Microcontroller (8 pins), Regulator (C6.1 C7.1 U2.1), Peripherals (9 pins)
VCC: RGB_Matrix (K1.1), LED Matrix (16 pins), Regulator (C6.2 U2.3)
VCC_P3V3: LED Driver (C1.2 C2.2 U3.32), Microcontroller (8 pins), Regulator (C7.2 U2.2 U2.4), Peripherals (9 pins)
NetD1_4: LED Matrix (8 pins), LED Driver (U3.7)
NetD1_5: LED Matrix (8 pins), LED Driver (U3.6)
NetD1_6: LED Matrix (8 pins), LED Driver (U3.5)
NetD2_4: LED Matrix (8 pins), LED Driver (U3.10)
NetD2_5: LED Matrix (8 pins), LED Driver (U3.9)
NetD2_6: LED Matrix (8 pins), LED Driver (U3.8)
NetD3_4: LED Matrix (8 pins), LED Driver (U3.13)
NetD3_5: LED Matrix (8 pins), LED Driver (U3.12)
NetD3_6: LED Matrix (8 pins), LED Driver (U3.11)
NetD4_4: LED Matrix (8 pins), LED Driver (U3.16)
NetD4_5: LED Matrix (8 pins), LED Driver (U3.15)
NetD4_6: LED Matrix (8 pins), LED Driver (U3.14)
NetD5_4: LED Matrix (8 pins), LED Driver (U3.19)
NetD5_5: LED Matrix (8 pins), LED Driver (U3.18)
NetD5_6: LED Matrix (8 pins), LED Driver (U3.17)
NetD6_4: LED Matrix (8 pins), LED Driver (U3.22)
NetD6_5: LED Matrix (8 pins), LED Driver (U3.21)
NetD6_6: LED Matrix (8 pins), LED Driver (U3.20)
NetD7_4: LED Matrix (8 pins), LED Driver (U3.25)
NetD7_5: LED Matrix (8 pins), LED Driver (U3.24)
NetD7_6: LED Matrix (8 pins), LED Driver (U3.23)
NetD8_4: LED Matrix (8 pins), LED Driver (U3.28)
NetD8_5: LED Matrix (8 pins), LED Driver (U3.27)
NetD8_6: LED Matrix (8 pins), LED Driver (U3.26)
NetJ2_2: Microcontroller (U1.20), Peripherals (J2.2)
NetQ1_2: LED Matrix (Q1.2), Microcontroller (U1.40)
NetQ2_2: LED Matrix (Q2.2), Microcontroller (U1.41)
NetQ3_2: LED Matrix (Q3.2), Microcontroller (U1.42)
NetQ4_2: LED Matrix (Q4.2), Microcontroller (U1.43)
NetQ5_2: LED Matrix (Q5.2), Microcontroller (U1.44)
NetQ6_2: LED Matrix (Q6.2), Microcontroller (U1.1)
NetQ7_2: LED Matrix (Q7.2), Microcontroller (U1.2)
NetQ8_2: LED Matrix (Q8.2), Microcontroller (U1.3)
NetR12_1: Microcontroller (U1.29), Peripherals (R12.1 U4.14)
NetR13_1: Microcontroller (U1.28), Peripherals (R13.1 U4.13)
NetR14_1: Microcontroller (U1.21), Peripherals (R14.1 SW1.3 SW1.4)
NetR15_1: Microcontroller (U1.22), Peripherals (R15.1 SW2.3 SW2.4)
NetU1_10: LED Driver (U3.30), Microcontroller (U1.10)
NetU1_11: LED Driver (U3.2), Microcontroller (U1.11)
NetU1_15: LED Driver (U3.4), Microcontroller (U1.15)
NetU1_17: LED Driver (U3.3), Microcontroller (U1.17)
NetU1_32: Microcontroller (U1.32), Peripherals (U4.8)
NetU1_33: Microcontroller (U1.33), Peripherals (U4.9)

## Assembly variants
Default assembly: not fitted C?